# Altium schematic sheet UART1.SchDoc
size A4
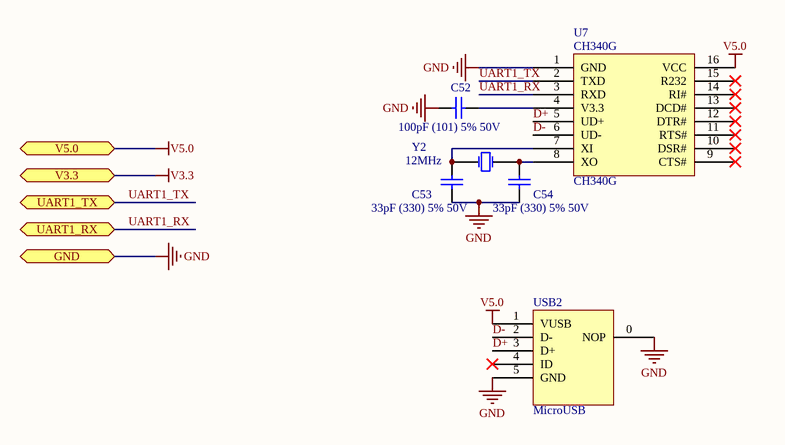
[diagram p0: UART1.SchDoc]

## Parts
C52  100pF (101) 5% 50V  [0805_C]
C53  33pF (330) 5% 50V  [0805_C]
C54  33pF (330) 5% 50V  [0805_C]
U7  CH340G  [SOIC-16_150mil]
USB2  MicroUSB  [MicroUSB]
Y2  12MHz  [Y]

## Ports
GND, UART1_RX, UART1_TX, V3.3, V5.0

## Nets
GND: C52.1 C53.2 C54.2 U7.1(GND) USB2.0(NOP) USB2.5(GND) ; port GND
V3.3: port V3.3
V5.0: U7.16(VCC) USB2.1(VUSB) ; port V5.0
D+: U7.5(UD+) USB2.3(D+)
D-: U7.6(UD-) USB2.2(D-)
UART1_RX: U7.3(RXD) ; port UART1_RX
UART1_TX: U7.2(TXD) ; port UART1_TX
NetC52_2: C52.2 U7.4(V3.3)
NetC53_1: C53.1 U7.7(XI) Y2.1(OSC1)
NetC54_1: C54.1 U7.8(XO) Y2.2(OSC2)

Not connected (* = marked no-connect by the designer): U7 9(CTS#)* 10(DSR#)* 11(RTS#)* 12(DTR#)* 13(DCD#)* 14(RI#)* 15(R232)*; USB2 4(ID)*

## Library data of the parts
C52 = 0805 100pF (101) 5% 50V: 贴片电容; ComponentLink1Description: 供应商链接; ComponentLink1URL: http://www.szlcsc.com/product/details_2142.html; Package: 0805; Supplier: LC; SuppliersPartNumber: C1790
C53 C54 = 0805 33pF (330) 5% 50V: 贴片电容; ComponentLink1Description: 供应商链接; ComponentLink1URL: http://www.szlcsc.com/product/details_2166.html; Package: 0805; Supplier: LC; SuppliersPartNumber: C1814
U7 = CH340G_[C14267]: USB; ComponentLink1Description: 供应商链接; ComponentLink1URL: http://www.szlcsc.com/product/details_14927.html; Package: SOIC-16_150mil; Supplier: LC; SuppliersPartNumber: C14267
Y2 = SMD-5032_2P 8MHz 20ppm 20pF: 贴片晶振; ComponentLink1Description: 供应商链接; ComponentLink1URL: http://www.szlcsc.com/product/details_117214.html; Package: SMD-5032_2P; Supplier: LC; SuppliersPartNumber: C115962